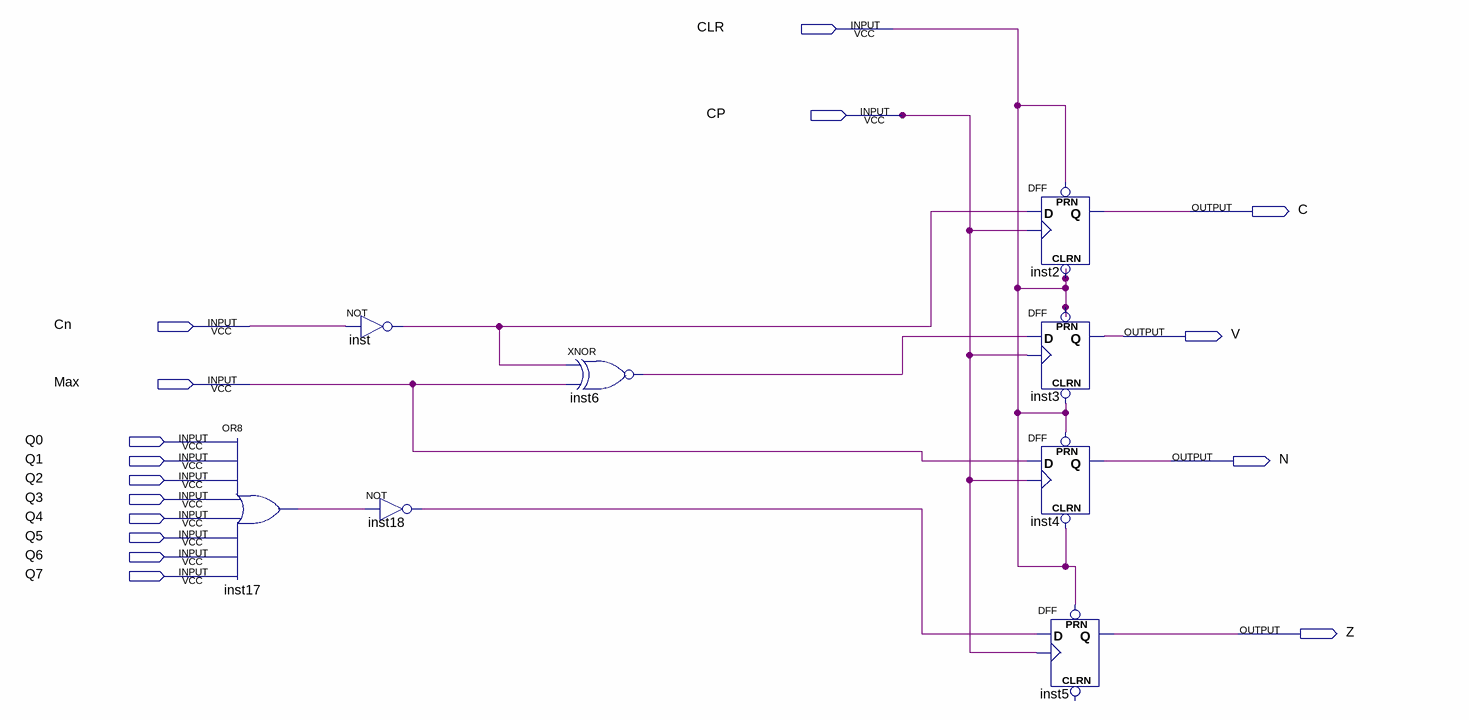
[diagram p0: schematic sheet]
// Quartus schematic psw.bdf as structural Verilog: 8 symbols, 16 pins
module psw (
  input  CLR,
  input  CP,
  input  Cn,
  input  Max,
  input  Q0,
  input  Q1,
  input  Q2,
  input  Q3,
  input  Q4,
  input  Q5,
  input  Q6,
  input  Q7,
  output C,
  output V,
  output N,
  output Z
);

  wire inst6_out, inst17_out, inst18_out, inst_out;

  or inst17 (inst17_out, Q0, Q1, Q2, Q3, Q4, Q5, Q6, Q7);
  not inst (inst_out, Cn);
  not inst18 (inst18_out, inst17_out);
  xnor inst6 (inst6_out, inst_out, Max);
  DFF inst2 (.CLRN(CLR), .CLK(CP), .D(inst_out), .PRN(CLR), .Q(C));
  DFF inst3 (.CLRN(CLR), .CLK(CP), .D(inst6_out), .PRN(CLR), .Q(V));
  DFF inst4 (.CLRN(CLR), .CLK(CP), .D(Max), .PRN(CLR), .Q(N));
  DFF inst5 (.CLK(CP), .D(inst18_out), .PRN(CLR), .Q(Z));  // open: CLRN
endmodule
